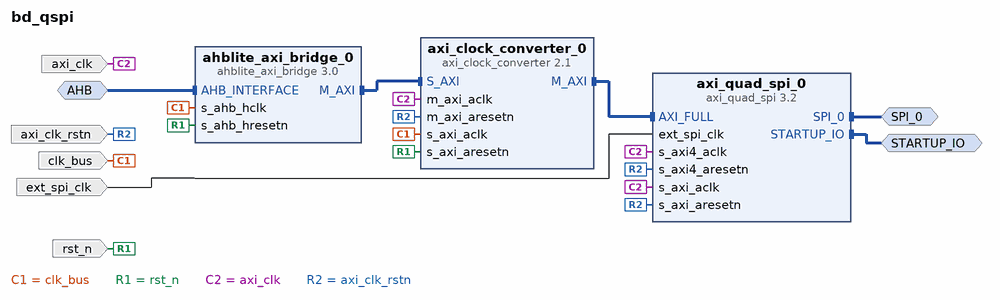
[diagram p0: block diagram of the top level]
# Vivado block design bd_qspi, xc7k160tffg676-2, Vivado 2017.3
create_bd_design bd_qspi

create_bd_intf_port -mode Slave -vlnv xilinx.com:interface:ahblite_rtl:2.0 AHB
create_bd_intf_port -mode Master -vlnv xilinx.com:interface:spi_rtl:1.0 SPI_0
create_bd_intf_port -mode Master -vlnv xilinx.com:display_startup_io:startup_io_rtl:1.0 STARTUP_IO
create_bd_port -dir I -type clk clk_bus
set_property -dict {CONFIG.FREQ_HZ 8000000} [get_bd_ports clk_bus]
create_bd_port -dir I -type rst rst_n
create_bd_port -dir I -type clk ext_spi_clk
set_property -dict {CONFIG.FREQ_HZ 40000000} [get_bd_ports ext_spi_clk]
create_bd_port -dir I -type clk axi_clk
set_property -dict {CONFIG.FREQ_HZ 100000000} [get_bd_ports axi_clk]
create_bd_port -dir I -type rst axi_clk_rstn

create_bd_cell -type ip -vlnv xilinx.com:ip:ahblite_axi_bridge:3.0 ahblite_axi_bridge_0
set_property -dict {CONFIG.C_M_AXI_THREAD_ID_WIDTH 0} [get_bd_cells ahblite_axi_bridge_0]
create_bd_cell -type ip -vlnv xilinx.com:ip:axi_clock_converter:2.1 axi_clock_converter_0
create_bd_cell -type ip -vlnv xilinx.com:ip:axi_quad_spi:3.2 axi_quad_spi_0
set_property -dict [list \
  CONFIG.C_SPI_MEMORY 3 \
  CONFIG.C_XIP_MODE 1 \
  CONFIG.C_SHARED_STARTUP 0 \
  CONFIG.C_TYPE_OF_AXI4_INTERFACE 1 \
] [get_bd_cells axi_quad_spi_0]

# ---- connections ----

connect_bd_intf_net [get_bd_intf_pins ahblite_axi_bridge_0/M_AXI] [get_bd_intf_pins axi_clock_converter_0/S_AXI]
connect_bd_intf_net [get_bd_intf_pins axi_clock_converter_0/M_AXI] [get_bd_intf_pins axi_quad_spi_0/AXI_FULL]
connect_bd_intf_net [get_bd_intf_ports AHB] [get_bd_intf_pins ahblite_axi_bridge_0/AHB_INTERFACE]
connect_bd_intf_net [get_bd_intf_ports SPI_0] [get_bd_intf_pins axi_quad_spi_0/SPI_0]
connect_bd_intf_net [get_bd_intf_ports STARTUP_IO] [get_bd_intf_pins axi_quad_spi_0/STARTUP_IO]
connect_bd_net -net s_ahb_hclk_1 [get_bd_ports clk_bus] [get_bd_pins ahblite_axi_bridge_0/s_ahb_hclk] [get_bd_pins axi_clock_converter_0/s_axi_aclk]
connect_bd_net -net s_ahb_hresetn_1 [get_bd_ports rst_n] \
  [get_bd_pins ahblite_axi_bridge_0/s_ahb_hresetn] [get_bd_pins axi_clock_converter_0/s_axi_aresetn]
connect_bd_net [get_bd_ports ext_spi_clk] [get_bd_pins axi_quad_spi_0/ext_spi_clk]
connect_bd_net -net m_axi_aclk_1 [get_bd_ports axi_clk] \
  [get_bd_pins axi_clock_converter_0/m_axi_aclk] [get_bd_pins axi_quad_spi_0/s_axi_aclk] \
  [get_bd_pins axi_quad_spi_0/s_axi4_aclk]
connect_bd_net -net m_axi_aresetn_1 [get_bd_ports axi_clk_rstn] \
  [get_bd_pins axi_clock_converter_0/m_axi_aresetn] [get_bd_pins axi_quad_spi_0/s_axi_aresetn] \
  [get_bd_pins axi_quad_spi_0/s_axi4_aresetn]

# ---- address map ----
assign_bd_address -offset 0x00000000 -range 16M -target_address_space [get_bd_addr_spaces AHB] [get_bd_addr_segs axi_quad_spi_0/aximm/MEM0]

validate_bd_design
save_bd_design
